# Altium schematic sheet KEY.SchDoc
size A4; SheetNumber: 7; SheetTotal: 10
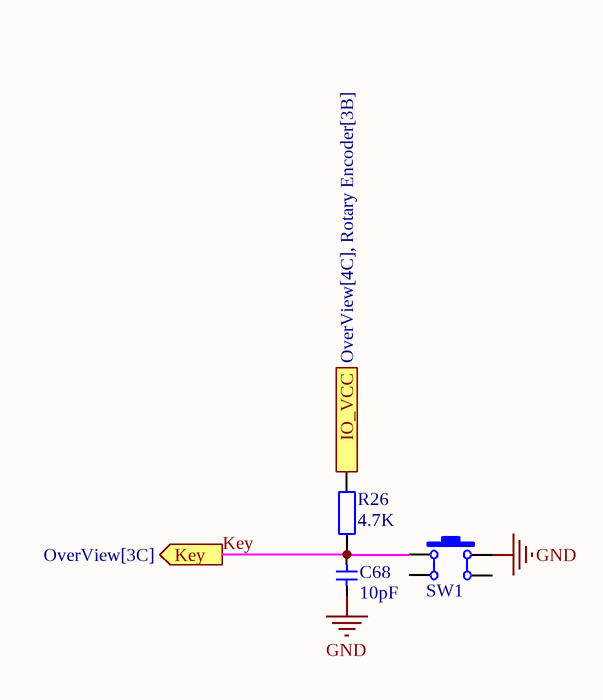
[diagram p0: KEY.SchDoc]

## Parts
C68  10pF  [0402_CAP]
R26  4.7K  [0402_RES]
SW1  TD-1187SA-250  [SW-SMD-3.5*3.0_4P]  (value not drawn)

## Ports
IO_VCC (in, see OverView[4C], Rotary Encoder[3B]), Key (out, see OverView[3C])

## Nets
GND: C68.1 SW1.2
IO_VCC: R26.2 ; port IO_VCC
Key: C68.2 R26.1 SW1.1 ; port Key

Not connected (* = marked no-connect by the designer): SW1 3 4

## Library data of the parts
C68 = C: Capacitor; Value: 0.1u
R26 = R: 贴片电阻; 联系下单店铺卖家 免费帮你查找封装: 联系下单店铺卖家 免费技术支持; BOM名称: 贴片电阻
SW1 = TD-1187SA-250: 小乌龟-侧按4脚开关 带定位柱; 联系下单店铺卖家 免费技术支持: 联系下单店铺卖家 免费帮你查找封装